# EAGLE design HDC100X-Breakout_v10 (EAGLE 7.7.0)
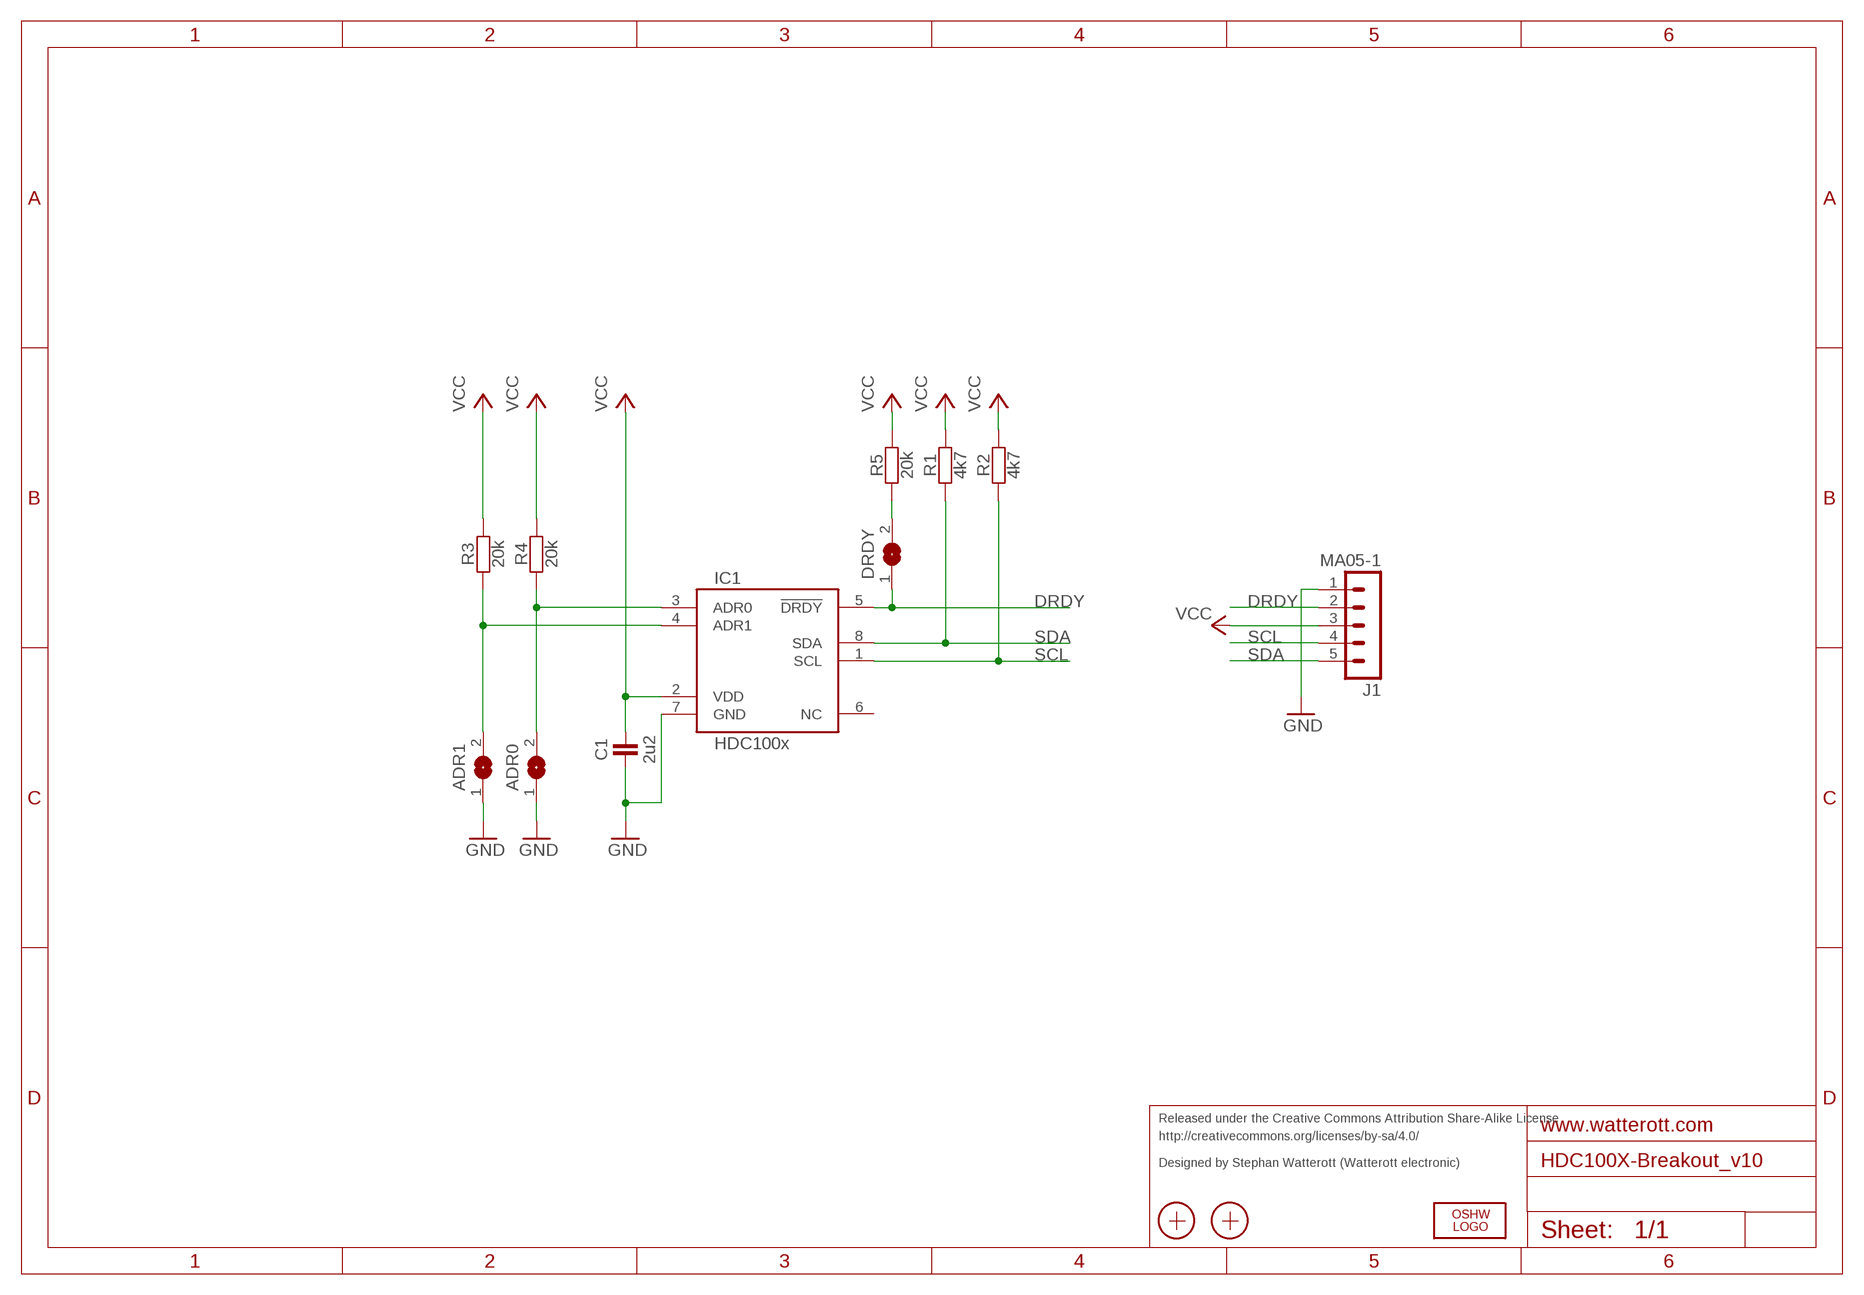
[diagram p0: schematic, sheet 1]

## Parts
ADR0  JUMPER2-0402  [JUMPER2-0402]
ADR1  JUMPER2-0402  [JUMPER2-0402]
C1  2u2  CAPACITOR-C0402  [R0402]
DRDY  JUMPER2-0402  [JUMPER2-0402]
IC1  HDC100x  HDC1008  [WLCSP]
J1  MA05-1  [MA05-1]
LOGO2  OSHW_LOGOX0070  [OSHW_6X70]
R1  4k7  RESISTOR-R0402  [R0402]
R2  4k7  RESISTOR-R0402  [R0402]
R3  20k  RESISTOR-R0402  [R0402]
R4  20k  RESISTOR-R0402  [R0402]
R5  20k  RESISTOR-R0402  [R0402]
X1  PASSER-07  [PASSER_07MM]
X2  PASSER-07  [PASSER_07MM]

## Nets
ADR0: ADR0.2 IC1.3(ADR0) R4.1
ADR1: ADR1.2 IC1.4(ADR1) R3.1
DRDY: DRDY.1 IC1.5(!DRDY) J1.2
GND: ADR0.1 ADR1.1 C1.1 IC1.7(GND) J1.1
N$3: DRDY.2 R5.1
SCL: IC1.1(SCL) J1.4 R2.1
SDA: IC1.8(SDA) J1.5 R1.1
VCC: C1.2 IC1.2(VDD) J1.3 R1.2 R2.2 R3.2 R4.2 R5.2
Unconnected: IC1.6(NC)

## Notes on the sheet
- Released under the Creative Commons Attribution Share-Alike License
- http://creativecommons.org/licenses/by-sa/4.0/
- Designed by Stephan Watterott (Watterott electronic)

## Library data of the parts
ADR0 ADR1 DRDY = we-rcl:JUMPER2: 2 Pin Jumpers
C1 = we-rcl:CAPACITOR: Capacitors ...4.7uF @ 6.3V -> 0402 ...10uF @ 16V -> 0603 ...22uF @ 25V -> 0805
IC1 = we-chip:HDC1008: TI HDC1008 Integrated Low Power Digital Humidity Sensor with Integrated Temperature Sensor; DIGIKEY: 296-38440
J1 = we-con:MA05-1: PIN HEADER; OC_FARNELL: unknown; OC_NEWARK: unknown
LOGO2 = we-symbol:OSHW_LOGO: Open-Source-Hardware Logo
R1-R5 = we-rcl:RESISTOR: Resistors all kinds in 0603 and 0402
X1 X2 = we-symbol:PASSER: Fiducial Markers

## Board
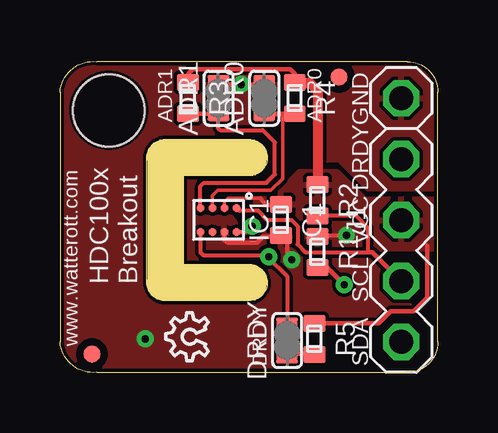
[diagram p1: board, top side]
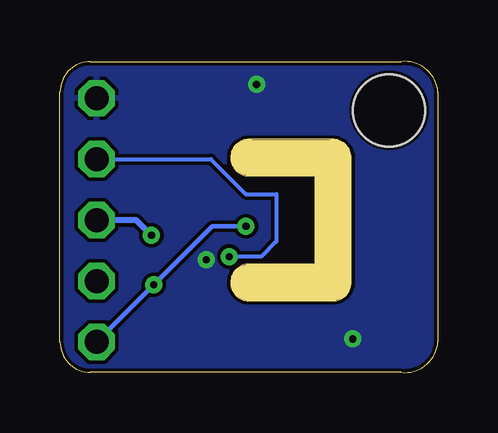
[diagram p2: board, bottom side, seen from below]

Size 15.75 x 12.97 mm. Coordinates in mm from the lower left corner, seen from the top.
Outline: 7.87,2.99 7.81,2.99
Outline: 7.81,2.99 4.32,2.99 arc-90 3.62,3.82 3.62,8.96 arc-90 4.38,9.72 7.94,9.72 arc-180 7.81,8.2 5.14,8.2 5.14,4.51 7.94,4.51 arc-180 7.81,2.99
Outline: 14.48,12.96 1.52,12.96 arc90 0,11.69 0,1.28 arc90 1.52,0.01 14.48,0.01 arc90 15.75,1.28 15.75,11.69 arc90 14.48,12.96
Copper layers (1*16): Top 0.035mm / dielectric 1.5mm / Bottom 0.035mm
Design rules "watterott *": minimum track width 0.15mm, minimum drill 0.3mm, track to track 6mil, track to pad 6mil, pad to pad 6mil, via to via 6mil, smd to smd 0.1mm, copper to edge 6mil, drill to drill 8mil, minimum pad ring 10mil, minimum via ring 8mil, stop-mask expansion 4mil, vias tented up to drill 0.4mm, thermal gap 6mil
Holes 3 mm at 2.03,10.93
Milling: 3 lines

### Footprints (pad centres in the part's own frame; a part is rotated, then mirrored left to right if it is on the bottom)
JUMPER2-0402 = smd 0.9 x 0.8: 1 0,0.55; 2 0,-0.55
R0402 = smd 0.9 x 0.7: 1 0,0.65; 2 0,-0.65
WLCSP = smd 0.335 x 0.335: 1 -0.5,0.75; 2 -0.5,0.25; 3 -0.5,-0.25; 4 -0.5,-0.75; 5 0.5,-0.75; 6 0.5,-0.25; 7 0.5,0.25; 8 0.5,0.75
MA05-1 = drill 1 octagon: 1 0,5.08; 2 0,2.54; 3 0,0; 4 0,-2.54; 5 0,-5.08
PASSER_07MM = smd 0.7 x 0.7: X 0,0

### Placement (x,y rotation side)
ADR0  8.51,11.44 0 top
ADR1  6.6,11.44 0 top
C1  9.21,6.36 180 top
DRDY  9.46,1.34 0 top
IC1  6.6,6.36 270 top
J1  14.22,6.36 0 top
LOGO2  6.18,0.5 90 top
R1  10.73,5.02 180 top
R2  10.73,7.18 180 top
R3  5.33,11.44 180 top
R4  9.78,11.44 180 top
R5  10.6,1.4 180 top
X1  11.62,12.32 0 top
X2  1.33,0.76 0 top

### Tracks (layer width: path | path; a pad name or v marks a point on that pad's centre or on a via)
ADR0
  Top 0.152: IC1.3 6.35,7.38 6.57,7.59 8.79,7.59 9.27,8.07 9.27,10.76
  Top 0.18: 9.27,10.76 8.51,10.76 ADR0.2 8.55,10.79 R4.1
ADR1
  Top 0.16: IC1.4 5.85,7.76 5.99,7.9 8.6,7.9 8.95,8.26 8.95,9.59 8.45,10.1 6.67,10.1 6.6,10.17 ADR1.2
  Top 0.18: R3.1 6.5,10.79 ADR1.2
DRDY  (via drill 0.3)
  Top 0.16: IC1.5 5.85,5.01 5.97,4.89 8.64,4.89 v8.7,4.83 | 8.64,4.83 9.46,4.01 DRDY.1
  Top 0.18: v8.7,4.83 8.64,4.83
  Bottom 0.16: J1.2 9.46,8.9 8,7.43 6.73,7.43 6.73,5.47 7.37,4.83 v8.7,4.83
GND  (via drill 0.3)
  Top 0.18: IC1.7 6.85,5.53 6.99,5.4 8.19,5.4 8.45,5.66 9.1,5.66 C1.1 9.46,5.39 9.46,5.02 9.78,4.7 9.78,4.45 | ADR1.1 ADR0.1
  other vias: 7.56,12.01 9.65,4.7 3.56,1.4
  pour Bottom: 0,0.01 15.75,0.01 15.75,12.96 0,12.96
  pour Top: 0,0.01 15.75,0.01 15.75,4.7 10.6,4.7 9.33,5.97 7.56,5.97 6.79,6.99 6.79,7.69 8.7,7.69 9.91,8.83 11.62,8.83 12.83,7.63 15.75,7.63 15.75,12.96 0,12.96
N$3
  Top 0.18: DRDY.2 10.82,0.79 R5.1
SCL
  Top 0.16: IC1.1 7.47,6.74 8.26,6.74 8.64,6.36 9.65,6.36 9.91,6.1 9.91,5.34 10.22,5.02 12.83,5.02 12.83,6.04 12.32,6.55 10.75,6.55 R2.1
  Top 0.18: IC1.1 7.37,6.86 | 12.83,5.02 13.02,5.02 J1.4
SDA  (via drill 0.3)
  Top 0.18: IC1.8 7.76,5.86 v8,6.1 | R1.1 11.13,4.37 v11.84,3.66
  Bottom 0.18: v8,6.1 9.4,6.1 v11.84,3.66 J1.5
VCC  (via drill 0.3)
  Top 0.152: IC1.2 6.85,7.11 7.01,7.27 8.34,7.27
  Top 0.16: 8.34,7.27 8.57,6.99 9.13,6.99 | R1.2 10.78,5.72 v11.94,5.72
  Top 0.18: 9.13,6.99 C1.2 | R4.2 9.78,12.45 9.59,12.64 5.52,12.64 5.33,12.45 R3.2 | R5.2 13.29,2.05 13.78,2.55 14.73,2.55 15.3,3.12 15.3,5.28
  Top 0.406: R4.2 10.4,12.09 10.73,11.75 R2.2
  Bottom 0.254: v11.94,5.72 12.57,6.36 J1.3
  pour Top: 8.13,7.31 8.89,7.31 9.97,8.39 11.56,8.39 12.7,7.24 15.62,7.24 15.62,5.15 10.67,5.15 10.29,5.53 10.29,5.85 9.72,6.42 8.32,6.42 8.13,6.61

### Text on the board
tPlace: GND | ADR1 | ADR0 | DRDY | VCC | SCL | HDC100x / Breakout | SDA | www.watterott.com | DRDY
Reference: Silkscreen: 21 tPlace + 22 bPlace